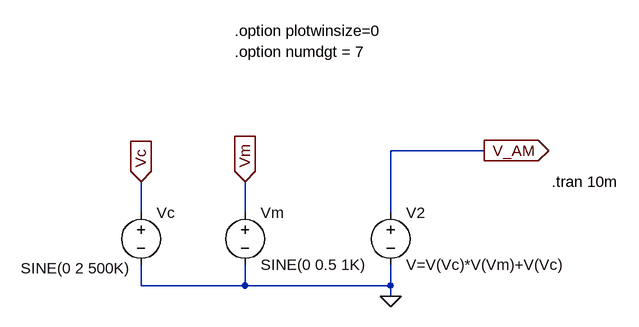
[diagram p0: schematic AM_Modulator_Spectrum_analyzer.asc]
AM_Modulator_Spectrum_analyzer.asc, the LTspice schematic file:
Version 4
SHEET 1 880 680
WIRE 272 32 128 32
WIRE -256 128 -256 80
WIRE -96 128 -96 80
WIRE 128 128 128 32
WIRE -256 240 -256 208
WIRE -96 240 -96 208
WIRE -96 240 -256 240
WIRE 128 240 128 208
WIRE 128 240 -96 240
WIRE 128 256 128 240
FLAG 128 256 0
FLAG 272 32 V_AM
IOPIN 272 32 Out
FLAG -96 80 Vm
IOPIN -96 80 In
FLAG -256 80 Vc
IOPIN -256 80 In
SYMBOL voltage 128 112 R0
SYMATTR InstName V2
SYMATTR Value V=V(Vc)*V(Vm)+V(Vc)
SYMATTR Prefix B
SYMBOL voltage -96 112 R0
WINDOW 123 0 0 Left 0
WINDOW 39 0 0 Left 0
SYMATTR InstName Vm
SYMATTR Value SINE(0 0.5 1K)
SYMBOL voltage -256 112 R0
WINDOW 123 0 0 Left 0
WINDOW 39 0 0 Left 0
WINDOW 3 -185 101 Left 2
SYMATTR InstName Vc
SYMATTR Value SINE(0 2 500K)
TEXT 376 80 Left 2 !.tran 10m
TEXT -112 -152 Left 2 !.option plotwinsize=0
TEXT -112 -120 Left 2 !.option numdgt = 7

The netlist it stands for:
* AM_Modulator_Spectrum_analyzer.asc
B§V2 V_AM 0 V=V(Vc)*V(Vm)+V(Vc)
Vm Vm 0 SINE(0 0.5 1K)
Vc Vc 0 SINE(0 2 500K)
.tran 10m
.option plotwinsize=0
.option numdgt = 7
.backanno
.end